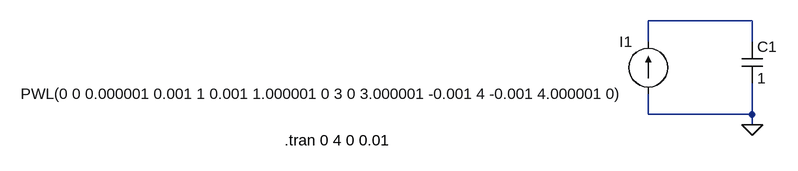
[diagram p0: schematic g1_p1.asc]
g1_p1.asc, the LTspice schematic file:
Version 4
SHEET 1 880 680
WIRE 192 16 32 16
WIRE 32 48 32 16
WIRE 192 48 192 16
WIRE 32 160 32 128
WIRE 192 160 192 112
WIRE 192 160 32 160
WIRE 192 176 192 160
FLAG 192 176 0
SYMBOL current 32 128 R180
WINDOW 0 24 80 Left 2
WINDOW 3 24 0 Left 2
WINDOW 123 0 0 Left 0
WINDOW 39 0 0 Left 0
SYMATTR InstName I1
SYMATTR Value PWL(0 0 0.000001 0.001 1 0.001 1.000001 0 3 0 3.000001 -0.001 4 -0.001 4.000001 0)
SYMBOL cap 176 48 R0
SYMATTR InstName C1
SYMATTR Value 1
TEXT -528 200 Left 2 !.tran 0 4 0 0.01

The netlist it stands for:
* g1_p1.asc
I1 0 N001 PWL(0 0 0.000001 0.001 1 0.001 1.000001 0 3 0 3.000001 -0.001 4 -0.001 4.000001 0)
C1 N001 0 1
.tran 0 4 0 0.01
.backanno
.end